# Altium schematic sheet Power.SchDoc
size Letter
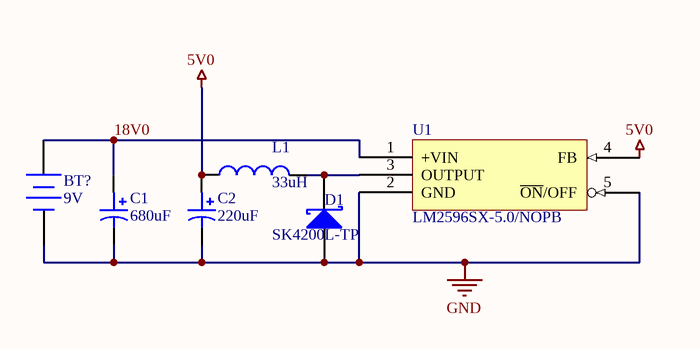
[diagram p0: Power.SchDoc]

## Parts
BT?  9V  [BAT-2]
C1  680uF  [Panasonic FM Series, Type A]
C2  220uF  [CAPMP7343X31N]
D1  SK4200L-TP  [DIOM6959X26N [DO-214AB]]
L1  33uH  [CDRH127]
U1  LM2596SX-5.0/NOPB  [TO-263-6, D2Pak]

## Nets
5V0: C2.1 L1.1 U1.4(FB)
GND: BT?.2(-) C1.2 C2.2 D1.2(A) U1.2(GND) U1.5(~{ON}/OFF)
18V0: BT?.1(+) C1.1 U1.1(+VIN)
NetD1_1: D1.1(K) L1.2 U1.3(OUTPUT)

## Library data of the parts
BT? = Battery: Multicell Battery; Published: 24-Mar-1999; LatestRevisionDate: 17-Jul-2002; LatestRevisionNote: Re-released for DXP Platform.; PackageReference: BAT-2; Publisher: Altium Limited; PackageDescription: Battery; 2 Leads
C1 = EEU-FM1E681: Panasonic CAP ALUM 680UF 25V 20% RADIAL; Value: 680uF; ComponentLink1Description: Datasheet; ComponentLink1URL: http://industrial.panasonic.com/www-data/pdf/ABA0000/ABA0000CE108.pdf; Supplier 1: Digi-Key; Supplier Part Number 1: P12390-ND
C2 = T491D227K010AT: Kemet CAP TANT 220UF 10V 10% 2917; Value: 220uF; Supplier 1: Digi-Key; Supplier Part Number 1: 399-8379-1-ND; ComponentLink1Description: Datasheet; ComponentLink1URL: http://www.kemet.com/Lists/ProductCatalog/Attachments/254/KEM_T2005_T491.pdf
D1 = SK4200L-TP: MCC DIODE SCHOTTKY 200V 4A DO214AB; ComponentLink1Description: Datasheet; ComponentLink1URL: http://www.mccsemi.com/up_pdf/SK4200L(SMC).pdf; Supplier 1: Digi-Key; Supplier Part Number 1: SK4200L-TPMSCT-ND
L1 = CDRH127NP-330MC: Sumida Fixed Inductors 33uH 3A; Value: 33uH; ComponentLink1Description: Datasheet; ComponentLink1URL: http://www.sumida.com/products/pdf/CDRH127,127LD.pdf
U1 = LM2596SX-5.0/NOPB: TI Power Converter 150 kHz  3A Step-Down Voltage Regulator; ComponentLink1URL: http://www.ti.com/lit/ds/symlink/lm2596.pdf; ComponentLink1Description: Datasheet; Supplier 1: Digi-Key; Supplier Part Number 1: LM2596SX-5.0/NOPBCT-ND